# Altium schematic sheet Sheet2.SchDoc
size A; SheetNumber: 1; SheetTotal: 1
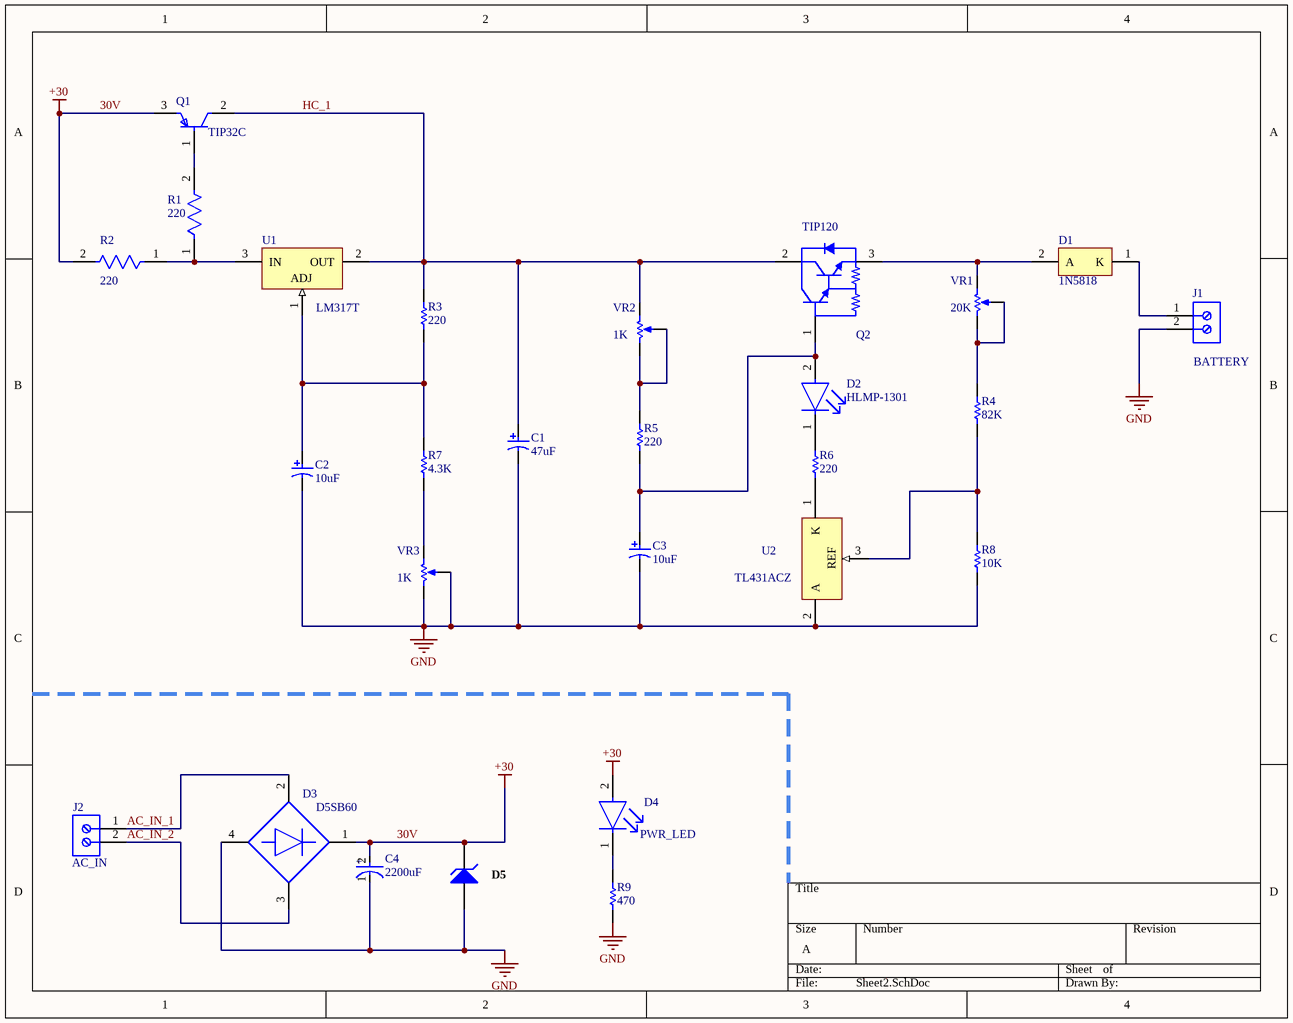
[diagram p0: Sheet2.SchDoc]

## Parts
C1  47uF  [CAPPR55-200-1100X500X1200]
C2  10uF  [CAPPR55-200-1100X500X1200]
C3  10uF  [CAPPR55-200-1100X500X1200]
C4  2200uF  [FP-RAD-TH-D_12_5_0_5-L_40-MFG]
D1  1N5818  [ONSC-AXIAL_LEAD-2-59-10_P]
D2  HLMP-1301  [FP-HLMP-1301-MFG]
D3  D5SB60  [FP-GBU-MFG]
D4  PWR_LED  [FP-HLMP-1503-MFG]
D5  1N4732A  [FAIR-DO-41-2_V]  (value not drawn)
J1  BATTERY  [PHOE-1714955_V]
J2  AC_IN  [PHOE-1714955_V]
Q1  TIP32C  [FP-TO-220-P0A0015988-MFG]
Q2  TIP120  [ONSC-TO-220-3-221A-09]
R1  220  [FP-SP3A-MFG]
R2  220  [FP-SP3A-MFG]
R3  220  [RESA60-630X240]
R4  82K  [RESA60-630X240]
R5  220  [RESA60-630X240]
R6  220  [RESA60-630X240]
R7  4.3K  [RESA60-630X240]
R8  10K  [RESA60-630X240]
R9  470  [RESA60-630X240]
U1  LM317T  [TO-220]
U2  TL431ACZ  [TO-92]
VR1  20K  [BOUR-3852A-282-103AL-3_V]
VR2  1K  [BOUR-3852A-282-103AL-3_V]
VR3  1K  [BOUR-3852A-282-103AL-3_V]

## Nets
30V: C4.2(A) D3.1(+) D4.2(A) D5.2(K) Q1.3(E) R2.2  [also labelled +30]
GND: C1.2 C2.2 C3.2 C4.1(C) D3.4(-) D5.1(A) J1.2 R8.1 R9.1 U2.2(A) VR3.2(S) VR3.3(CW)
AC_IN_1: D3.2(1_~) J2.1
AC_IN_2: D3.3(2_~) J2.2
HC_1: C1.1 Q1.2(C) Q2.2(C) R3.2 U1.2(OUT) VR2.1(CCW)
NetC2_1: C2.1 R3.1 R7.2 U1.1(ADJ)
NetC3_1: C3.1 D2.2(A) Q2.1(B) R5.1
NetD1_1: D1.1(K) J1.1
NetD1_2: D1.2(A) Q2.3(E) VR1.1(CCW)
NetD2_1: D2.1(C) R6.2
NetD4_1: D4.1(C) R9.2
NetQ1_1: Q1.1(B) R1.2
NetR1_1: R1.1 R2.1 U1.3(IN)
NetR4_1: R4.1 R8.2 U2.3(REF)
NetR4_2: R4.2 VR1.2(S) VR1.3(CW)
NetR5_2: R5.2 VR2.2(S) VR2.3(CW)
NetR6_1: R6.1 U2.1(K)
NetR7_1: R7.1 VR3.1(CCW)

## Notes on the sheet
- (in symbol CMP-05427-000828-1) +

## Library data of the parts
C1 = CMP-1665-00038-2: Aluminum Electrolytic Capacitor, 10 uF, +/- 20%, 50 V, -40 to 85 degC, 2-Pin THD, RoHS, Bulk; Manufacturer: Panasonic; Life (Hours): 2000Hour; Lead/Base Style: Straight; Dissipation Factor: 0.12%; Capacitance: 10uF; Leakage Current: 3uA; Dielectric Material: Aluminium; Lead Diameter: 0.5mm; Voltage Rating: 50V; Ripple Current: 65mA; Package Reference: CAPPR55-200-1100X500X1200; Height: 11mm; Diameter: 5mm; REACH SVHC: NoSVHC; Mount: ThroughHole; Packaging: Bulk; Manufacturer URL: http://www.panasonic.com/; Termination: Radial; Datasheet URL: https://industrial.panasonic.com/cdbs/www-data/pdf/RDF0000/ABA0000C1218.pdf; Lead Free: LeadFree; Height - Seated (Max): 0.472inch; Case/Package: Radial; Package Description: 2-Pin Radial Lead, Dia 5 mm, Height 12 mm; Tolerance: 20%; Datasheet Version: Rev. 05, 10/2016; Package Quantity: 200; Ripple Current (AC): 65mA; Min Operating Temperature: -40degC; RoHSCompliant: true; Number of Pins: 2; Max Operating Temperature: 85degC; Voltage: 50V; Lead Pitch: 2mm; Radiation Hardening: No; Voltage Rating (DC): 50V; Length: 11mm
C2 C3 = CMP-1665-00038-2: Aluminum Electrolytic Capacitor, 10 uF, +/- 20%, 50 V, -40 to 85 degC, 2-Pin THD, RoHS, Bulk; Manufacturer: Panasonic; Life (Hours): 2000Hour; Lead/Base Style: Straight; Dissipation Factor: 0.12%; Leakage Current: 3uA; Dielectric Material: Aluminium; Lead Diameter: 0.5mm; Voltage Rating: 50V; Ripple Current: 65mA; Package Reference: CAPPR55-200-1100X500X1200; Height: 11mm; Diameter: 5mm; REACH SVHC: NoSVHC; Mount: ThroughHole; Packaging: Bulk; Manufacturer URL: http://www.panasonic.com/; Capacitance: 10uF; Termination: Radial; Datasheet URL: https://industrial.panasonic.com/cdbs/www-data/pdf/RDF0000/ABA0000C1218.pdf; Lead Free: LeadFree; Height - Seated (Max): 0.472inch; Case/Package: Radial; Package Description: 2-Pin Radial Lead, Dia 5 mm, Height 12 mm; Tolerance: 20%; Datasheet Version: Rev. 05, 10/2016; Package Quantity: 200; Ripple Current (AC): 65mA; Min Operating Temperature: -40degC; RoHSCompliant: true; Number of Pins: 2; Max Operating Temperature: 85degC; Voltage: 50V; Lead Pitch: 2mm; Radiation Hardening: No; Voltage Rating (DC): 50V; Length: 11mm
C4 = CMP-05427-000828-1: Aluminum Electrolytic Capacitors (Radial Lead Type) AEC-Q200 Qualified 2200uF ±20% 35V; Impedance: 14mR; Ripple Current: 3.01A; Life (Hours): 5000Hour; Lead Diameter: 0.8mm; Capacitance: 2.2mF; Dielectric Material: Aluminium; Tolerance: 20%; Mount: Through Hole; Case/Package: Radial; Voltage Rating: 35V; Height: 40mm; Radiation Hardening: No; REACH SVHC: No SVHC; Ratings: AEC-Q200; Contact Plating: Tin; Number of Pins: 2; Packaging: Bulk; Min Operating Temperature: -55°C; Construction: RADIAL; Series: FK; Max Operating Temperature: 105°C; Package Quantity: 100; Termination: Radial; Voltage: 35V; Diameter: 12.5mm; Length: 40mm; Voltage Rating (DC): 35V; Lead Pitch: 5mm
D1 = CMP-1055-00034-1: Rectifier, 2-Pin Axial_Lead, Pb-Free, Bulk Bag; Manufacturer: On Semiconductor; IFSM Max (A): 25; Note1: 0; Configuration: Single; ComponentLink1Description: Manufacturer URL; ComponentLink3URL: http://www.onsemi.cn/pub_link/Collateral/59-10.PDF; PackageVersion: Rev. U, 02/2005; RoHS: TRUE; PartNumber: 1N5818; ComponentLink1URL: http://www.onsemi.com/; ComponentLink2URL: http://www.onsemi.cn/pub_link/Collateral/1N5817-D.PDF; PackageDescription: 2-Pin, Axial Lead, Diameter 2.35 mm; Packing: Bulk Bag; ComponentLink2Description: Datasheet; DatasheetVersion: Rev. 10; PackageReference: AXIAL_LEAD-2-59-10; Mounting Technology: Through Hole; ComponentLink3Description: Package Specification
D2 = CMP-18399-000007-1: LED RED DIFFUSED T-1 T/H; Manufacturer: Broadcom; Forward Current: 10mA; Max Junction Temp: +110°C; Wavelength: 626nm; Led Orientation: Straight; Viewing Angle: 60°; Luminous Intensity: 3.4mcd; Forward Voltage: 1.9V; Reverse Voltage: 5V; Peak Emmision Wavelength: 635nm; Mouser Description: Standard LEDs - Through Hole Red Diffused 635nm 3.4mcd; RoHS: TRUE; ComponentLink2Description: Datasheet; Device Class L1: Optoelectronics; Temperature Range High: +100°C; Manufacturer Part Number: HLMP-1301; ComponentLink2URL: https://docs.broadcom.com/docs/AV02-1555EN; Colour: Red; Digikey Description: LED RED DIFFUSED T-1 T/H; Automotive: No; Device Class L2: LEDs; Temperature Range Low: -40°C; Octopart: https://octopart.com/hlmp-1301-broadcom-71130345; Category: Diode; Lead Free: Yes; Device Class L3: unset; Package: 0; Temperature: -40°C to +100°C
D3 = CMP-02540-000020-1: BRIDGE RECT 1PHASE 800V 3.9A GBU; Manufacturer: Vishay; Manufacturer Part Number: GBU8K-E3/45; Peak Reverse Current: 5uA; Max Junction Temp: +150°C; Standoff Height: 1.52mm; Capacitance: 68pF; Max Surge Forward Current: 200A; Value: 68pF; ComponentLink2Description: Datasheet; Device Class L3: Rectifier Diodes; Mouser Description: Bridge Rectifiers 800 Volt 8.0 Amp Glass Passivated; Device Class L2: Diodes; Lead Free: Yes; RoHS: TRUE; Temperature Range Low: -55°C; Forward Current: 3.9A; Temperature Range High: +150°C; Max Repetitive Reverse Voltage: 800V; Height: 20.83mm; Octopart: https://octopart.com/gbu8k-e3%2F45-vishay-42337698; Category: Diode; Automotive: No; Device Class L1: Discrete Semiconductors; Temperature: -55°C to +150°C; Package: GBU; ComponentLink2URL: https://www.vishay.com/docs/88616/gbu8a.pdf; Digikey Description: BRIDGE RECT 1PHASE 800V 3.9A GBU
D4 = CMP-18399-000010-1: LED GREEN DIFFUSED T-1 T/H; Manufacturer: Broadcom; Reverse Voltage: 5V; Wavelength: 569nm; Forward Voltage: 2.1V; Led Orientation: Straight; Viewing Angle: 60°; Max Junction Temp: +110°C; Peak Emmision Wavelength: 565nm; Luminous Intensity: 1mcd; Standoff Height: 0.88mm; Forward Current: 10mA; Mouser Description: LED; Green; 1mcd; 0.115In.Dia.; T-1; 565nm; 25mA; 2.1V; 5V; GaP; -20degC; 100deg; ComponentLink2Description: Datasheet; Digikey Description: LED GREEN DIFFUSED T-1 T/H; Device Class L1: Optoelectronics; Device Class L3: unset; Automotive: No; Device Class L2: LEDs; Manufacturer Part Number: HLMP-1503; Category: Diode; Temperature Range Low: -20°C; Height: 6.35mm; RoHS: TRUE; Octopart: https://octopart.com/hlmp-1503-broadcom-71130371; Temperature: -20°C to +100°C; Lead Free: Yes; ComponentLink2URL: https://docs.broadcom.com/docs/AV02-1555EN; Package: HLMP-1503; Colour: Green; Temperature Range High: +100°C
D5 = CMP-0892-00030-1: Zener Diode, 4.7V, 1W, 5%, -65 to 200 degC, 2-Pin DO-41, Body 2.72 x 5.2 mm, RoHS; Manufacturer: Fairchild Semiconductor; VZ (Min.) (V): 4.465; ZZ (Max) (ohm): 8; VZ (Max.) (V): 4.935; PD (W): 1; IR (uA): 10; Test Current IZ (mA): 53; DatasheetVersion: Rev. H3; ComponentLink3Description: Package Specification; PartNumber: 1N4732A; PackageReference: DO-41-2; PackageVersion: Rev. 2; ComponentLink1Description: Manufacturer URL; Operating and Storage Temperature Range: -65 to 200 degC; PackageDescription: 2-Pin Axial leaded, Body 2.72 x 5.2 mm, Lead Spread 25.4 mm; ComponentLink2URL: http://www.fairchildsemi.com/ds/1N/1N4744A.pdf; Tolerance: 5%; ComponentLink2Description: Datasheet; Mounting Technology: Through Hole; RoHS: TRUE; ComponentLink3URL: http://www.fairchildsemi.com/dwg/DO/DO41A.pdf; ComponentLink1URL: http://www.fairchildsemi.com/
J1 J2 = CMP-2000-05797-1: PC Terminal Block, Pitch 6.35 mm, 1 x 2 Position, Height 21.5 mm, Tail Lenght 5.1 mm, RoHS, Bulk; Manufacturer: Phoenix Contact; Package Description: PC Terminal Block, Pitch 6.35 mm, 1 x 2 Position, Height 21.5 mm, Tail Lenght 5.1 mm; Datasheet URL: http://media.digikey.com/pdf/Data%20Sheets/Phoenix%20Contact%20PDFs/1714955.pdf; Package Reference: 1714955; Manufacturer URL: http://www.phoenixcontact.com/; Datasheet Version: 02/2010; Mounting Technology: ThroughHole
Q1 = CMP-12195-000005-1: TRANS PNP 100V 3A TO-220; Manufacturer: STMicroelectronics; Standoff Height: 3.5mm; Number Of Pnp: 1; Max Collector Current: -3A; Emitter Base Voltage: -5V; Collector Emitter Voltage: -100V; Hfe Testvce: -4V; Hfe Max: 50; Collector Emitter Saturation Voltage: -1.2V; Power Dissipation: 2W; Max Junction Temp: +150°C; Hfe Min: 10; Device Class L3: BJTs; Mouser Description: Original ST Microelectronics Transistor, 100V, 3A, .22 Ohm, TO-220 Package; ComponentLink2Description: Datasheet; Device Class L1: Discrete Semiconductors; Automotive: No; Number Of Elements: 1; Category: Trans; Collector Base Voltage: -100V; Package: TO-220-P0A0015988; Height: 19.68mm; Lead Free: Yes; ComponentLink2URL: https://www.st.com/resource/en/datasheet/tip32c.pdf; Hfe Testic: -3A; RoHS: TRUE; Temperature Range High: +150°C; Temperature: to +150°C; Device Class L2: Transistors; Digikey Description: TRANS PNP 100V 3A TO-220; Octopart: https://octopart.com/tip32c-stmicroelectronics-353617; Manufacturer Part Number: TIP32C
Q2 = CMP-1047-00140-1: Plastic Medium-Power, Complementary Silicon Transistor, 3-Pin TO-220, Tube; Manufacturer: On Semiconductor; IC Continuous (A): 5; Polarity: NPN; ComponentLink2URL: http://www.onsemi.cn/pub_link/Collateral/TIP120-D.PDF; Packing: Tube; PartNumber: TIP120; ComponentLink3Description: Package Specification; PackageDescription: 3-Pin Flange Mount, Vertical Straight Lead, Body 9.97 x 4.445 mm, Pitch 2.54 mm; Mounting Technology: Through Hole; ComponentLink1URL: http://www.onsemi.com/; PackageVersion: Rev. AG, 09/2011; ComponentLink1Description: Manufacturer URL; PackageReference: TO-220-3-221A-09; ComponentLink2Description: Datasheet; RoHS: FALSE; DatasheetVersion: Rev. 8; ComponentLink3URL: http://www.onsemi.com/pub_link/Collateral/221A-09.PDF
R1 R2 = CMP-26528-000004-1: RES 10 OHM 5% 4W AXIAL; Resistance: 10R; Temperature Coefficient: 20ppm/°C; Power Rating: 4W; Series: SP; Mount: Through Hole; Diameter: 5.5mm; RoHS Compliant: Yes; Length: 12.7mm; Max Operating Temperature: 350°C; Max Power Dissipation: 4W; Number of Terminations: 2; Resistor Type: Wirewound; Min Operating Temperature: -55°C; Case/Package: Axial; Tolerance: 5%; Package Quantity: 1; Packaging: Cut Tape
R3-R9 = CMP-1659-00075-1: Axial Resistor, 1 KOhm, +/- 1%, 250 mW, -55 to 155 degC, 2-Pin THD, RoHS, Bulk; Voltage Rating: 250 V; Resistance: 10 kohm; Power Rating: 250 mW; ComponentLink2Description: Datasheet; RoHSCompliant: true; PackageReference: MFR-25; Case\Package: Axial; Max Operating Temperature: 155 degC; DatasheetVersion: Apr-13; Tolerance: 1%; ComponentLink1URL: http://www.yageo.com/; Length: 0.248 inch; ComponentLink2URL: http://www.yageo.com/documents/recent/Yageo%20LR_MFR_2013.pdf; Packaging: Bulk; Package Quantity: 200; PackageDescription: 2-Pin Axial Lead, Dia 2.4 mm, Body Length 6.3 mm; Min Operating Temperature: -55 degC; ComponentLink1Description: Manufacturer URL
U1 = CMP-0244-00444-1: 1.5A, 1.2V to 37V Adjustable Voltage Regulator, 3-Pin TO-220; PackageVersion: 2011; ComponentLink1URL: http://www.st.com; ComponentLink2URL: http://www.st.com/internet/com/TECHNICAL_RESOURCES/TECHNICAL_LITERATURE/DATASHEET/CD00000455.pdf; PackageDescription: TO, Thru-Hole, Vertical, Heatsink Mounted; 3 In-Line Leads; Pitch 2.54 mm; PackageReference: TO-220; ComponentLink1Description: Manufacturer URL; ComponentLink3URL: http://www.st.com/internet/com/TECHNICAL_RESOURCES/TECHNICAL_LITERATURE/PACKAGE_INFORMATION/CD00004649.pdf; DatasheetVersion: 1/11/2011; ComponentLink2Description: Datasheet; ComponentLink3Description: Package Specification
U2 = CMP-0242-00006-1: Programmable Voltage Reference, 2.5 to 36V, 3-Pin TO-92; ComponentLink2URL: http://www.st.com/internet/com/TECHNICAL_RESOURCES/TECHNICAL_LITERATURE/DATASHEET/CD00000986.pdf; PackageDescription: TO, Flat Index; 3 In-Line, Axial Leads; Body Dia. 4.7mm; Lead Dia. 0.56 mm (max); ComponentLink1Description: Manufacturer URL; PackageVersion: 2011; ComponentLink2Description: Datasheet; ComponentLink1URL: http://www.st.com; DatasheetVersion: Oct-2011; PackageReference: TO-92
VR1-VR3 = CMP-2000-05079-1: Diameter Panel Control, 10 KOhm, +/- 10%, 2 W, -1 to 125 degC, 3-Pin THD, RoHS, Bulk; Manufacturer: Bourns; Temperature Coefficient: ±150ppm/degC; Number of Gangs: 1; Other Names: 3852A282103AL; Actuator Length: 0.875"(22.23mm); Resistive Material: Cermet; PCN Design/Specification: PBTResinJun/2011; Rotation: 280deg; PCN Other: MultipleChanges01/Dec/2012; Catalog Drawings: 3852SeriesSide1 / 3852SeriesSide2; Online Catalog: 3852and3856Series; Associated Product: 36-8560-ND / -KNOBINSTRUMW/DIALRND.9"DIA / 36-8555-ND / -KNOBINSTRUMSKIRTEDRND.7"DIA / 36-8556-ND / -KNOBINSTRUMSKIRTEDRND.9"DIA / 36-8565-ND / -KNOBINSTRUMDBLBARRND.7"DIA / 36-8566-ND / -KNOBINSTRUMDBLBARRND.9"DIA / 36-8568-ND / -KNOBINSTRUMSGLBARRND.7"DIA / 36-8569-ND / -KNOBINSTRUMSGLBARRND.9"DIA / 36-8559-ND / -KNOBINSTRUMW/DIALRND.7"DIA / 226-1006-ND / -KNOBBLKGLOSS.75"DIA.250"SHAFT / 226-1007-ND / -KNOBBLKGLOSS.925"DIA.250"SHAFT / 226-1011-ND / -KNOBBLKGLOS; Actuator Diameter: 0.250"(6.35mm); Built in Switch: None; Resistance (Ohms): 10k; Power (Watts): 2W; Actuator Type: Slotted; Standard Package: 45; Tolerance: ±10%; Taper: Linear; Series: 3852; Packaging: Bulk; Category: Potentiometers,VariableResistors; Bushing Thread: 3/8-32; Datasheet URL: https://datasheet.ciiva.com/11831/0900766b80f93b4b-11831016.pdf; Datasheet Version: Sep-14; Number of Turns: 1; Family: RotaryPotentiometers,Rheostats; Termination Style: SolderLug; RoHS Information: 3852A-LMaterialDeclaration; Mounting Type: PanelMount; Manufacturer URL: http://www.bourns.com/